# EasyEDA schematic LM471-2.json
TITLE: Sheet_1; REV: 1.0; Date: 2024-01-02; Sheet: 1/1; Company: Your Company
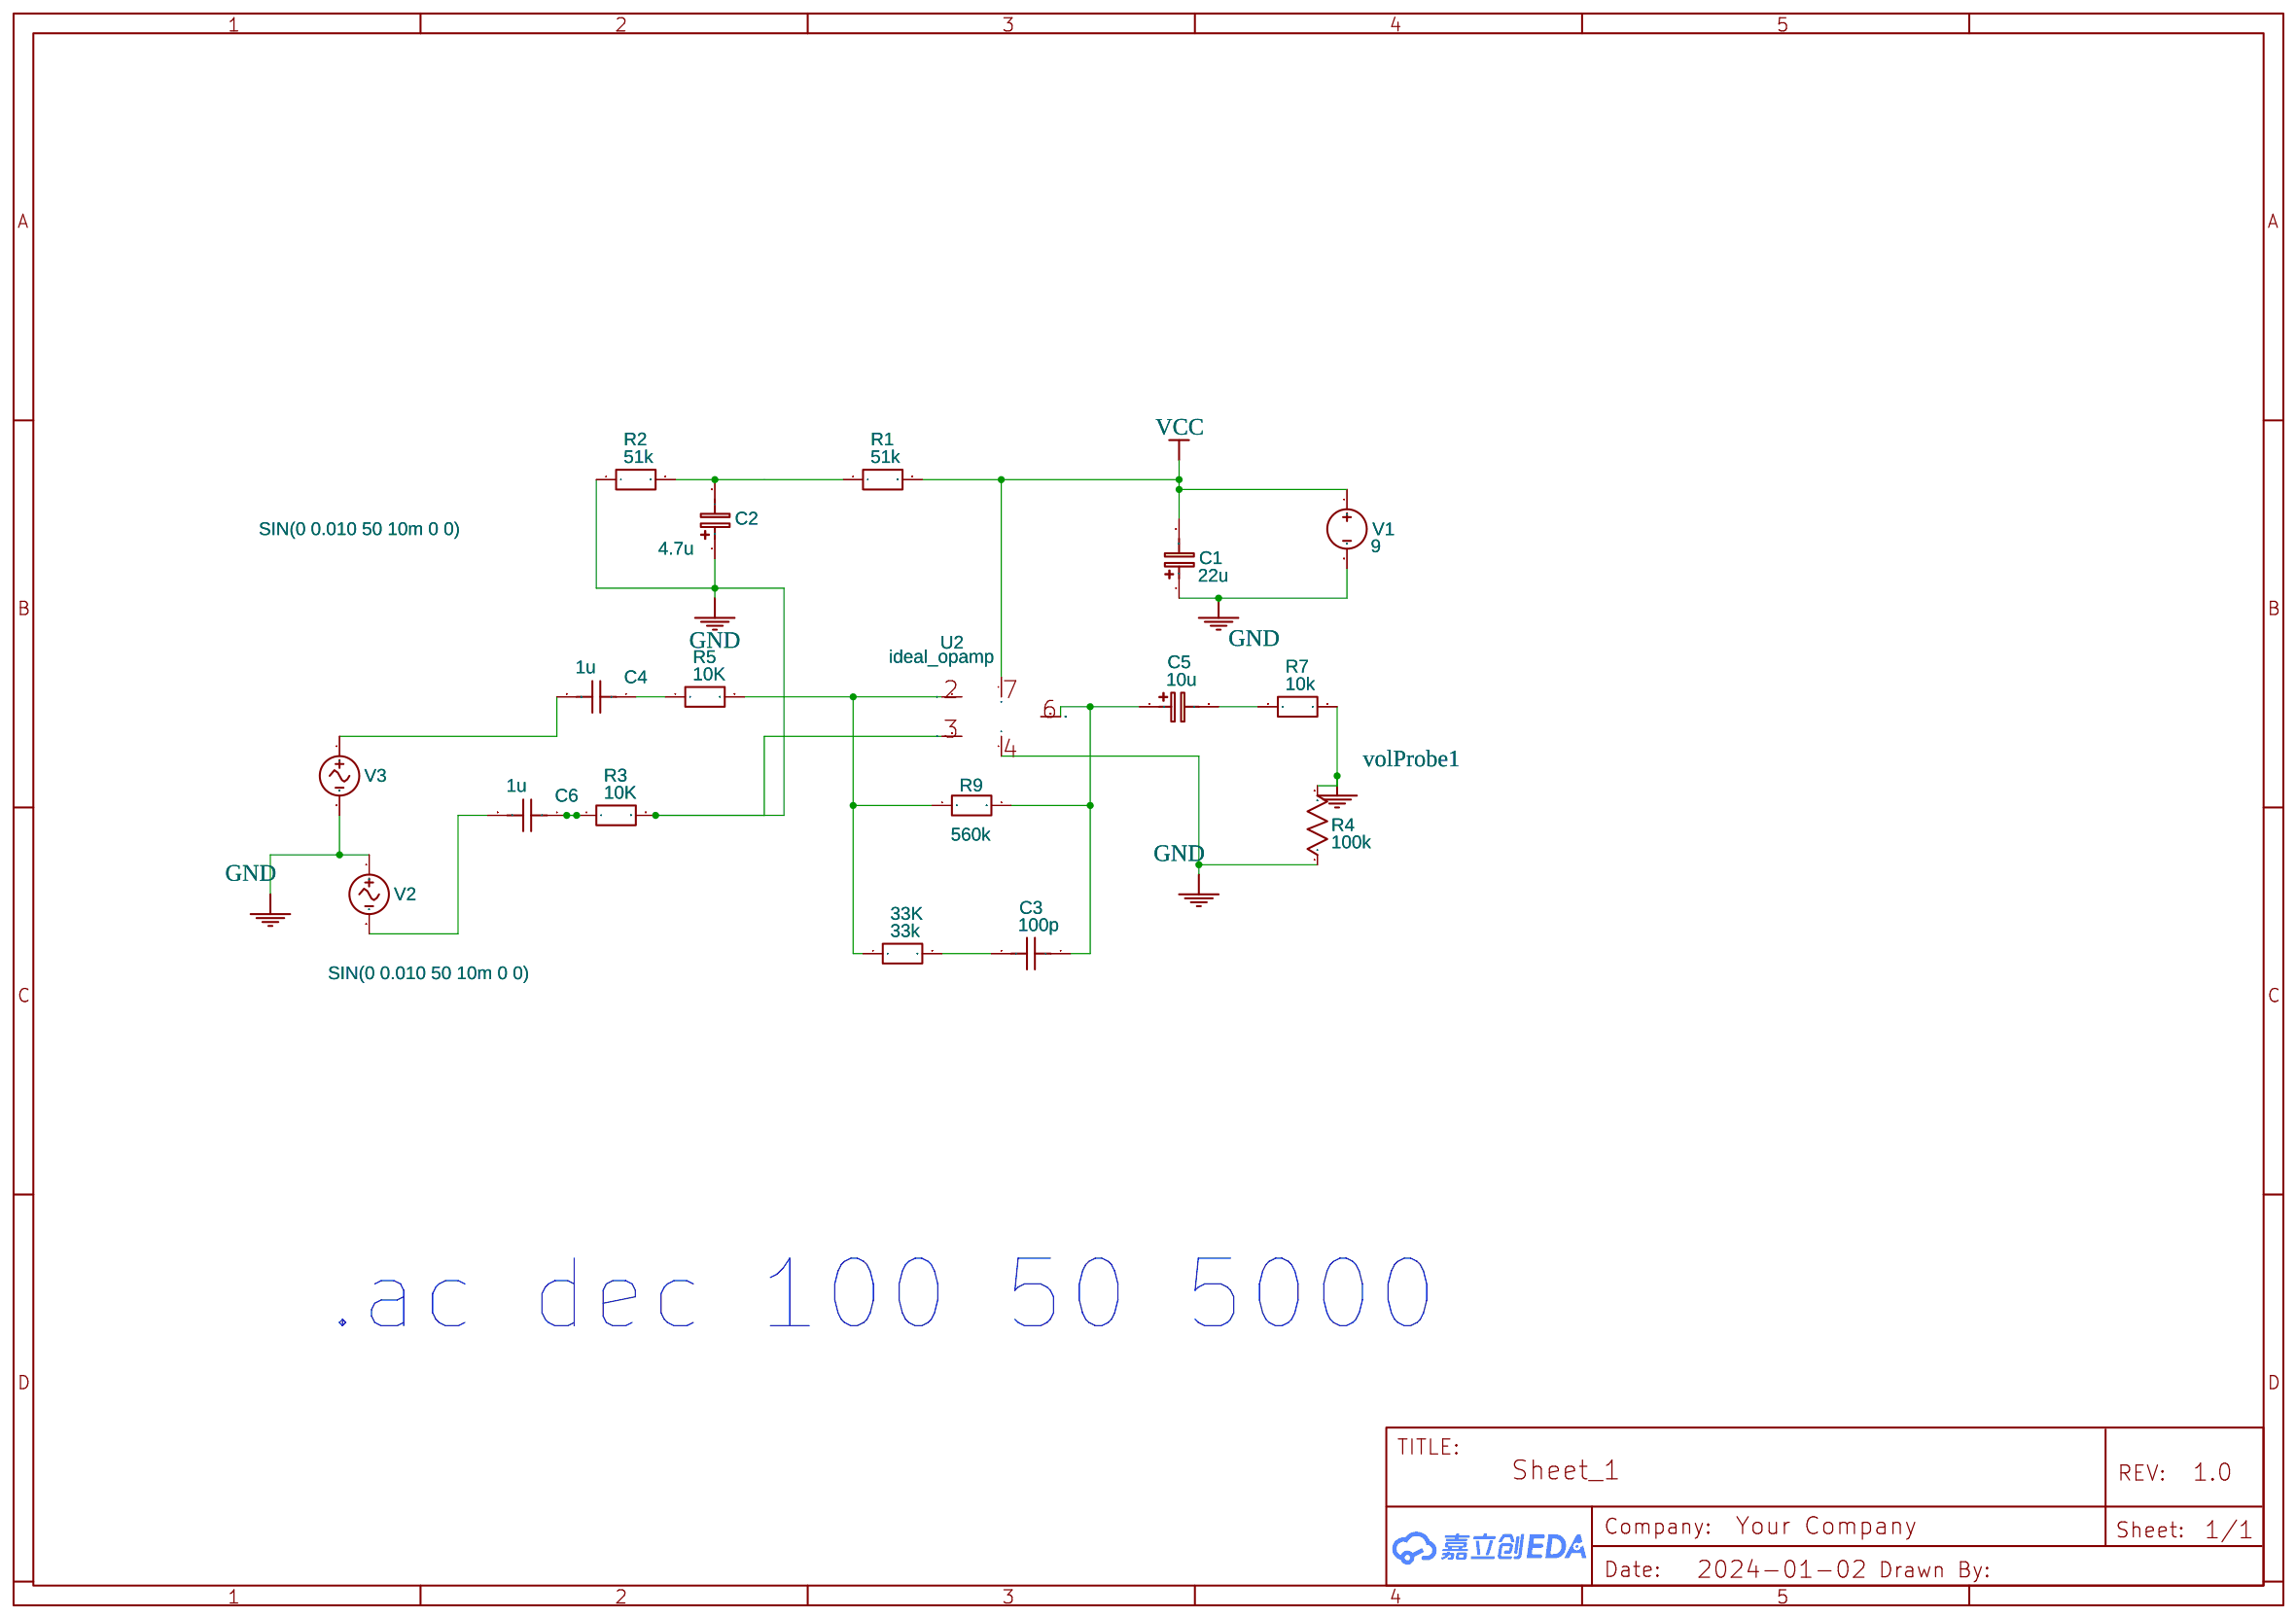
[diagram p0: schematic sheet]

## Parts
33K  33k  [R0603]
C1  22u  [SMD]
C2  4.7u  [SMD]
C3  100p  [RAD-0.1]
C4  1u  [RAD-0.1]
C5  10u  [SMD]
C6  1u  [RAD-0.1]
R1  51k  [R0603]
R2  51k  [R0603]
R3  10K  [R0603]
R4  100k  [AXIAL-0.3]
R5  10K  [R0603]
R7  10k  [R0603]
R9  560k  [R0603]
U2  ideal_opamp  [LM741CN-DIP-8]
V1  9  [HDR1X2]
V2  SIN(0 0.010 50 10m 0 0)  [HDR1X2]
V3  SIN(0 0.010 50 10m 0 0)  [HDR1X2]

## Library data of the parts
33K R1-R3 R5 R7 R9 = R_0603_EU: Contributor: LCEDA_Lib
C1 C2 C5 = C_Tan_SMD_A_EU: Contributor: LCEDA_Lib
C3 = Capacitor_US: Contributor: EasyEDA; Supplier: YUJING; Capacitance: 1u
C4 C6 = Capacitor_US: Contributor: EasyEDA; Supplier: YUJING
R4 = Resistor_US: Resistance: 1k; Contributor: EasyEDA; Supplier: YUJING
U2 = LM741: Contributor: juan_g2; sim: true
V1 = VDC: Contributor: EasyEDA; sim: true
V2 V3 = VSin: Contributor: EasyEDA; sim: true; AC_Amplitude: AC 1

## Nets
GND: C1.1 C2.1 R2.1 R3.2 R4.1 U2.3(IN+) U2.4(V-) V1.2 V2.1 V3.2
VCC: C1.2 R1.2 U2.7(V+) V1.1
volProbe1: R4.2 R7.2
Net-(33K-1): 33K.1 R5.2 R9.1 U2.2(IN-)
Net-(33K-2): 33K.2 C3.2
Net-(C2-2): C2.2 R1.1 R2.2
Net-(C3-1): C3.1 C5.1 R9.2 U2.6(OUT)
Net-(C4-1): C4.1 R5.1
Net-(C4-2): C4.2 V3.1
Net-(C5-2): C5.2 R7.1
Net-(C6-1): C6.1 R3.1
Net-(C6-2): C6.2 V2.2

## Notes on the sheet
- .ac dec 100 50 5000
